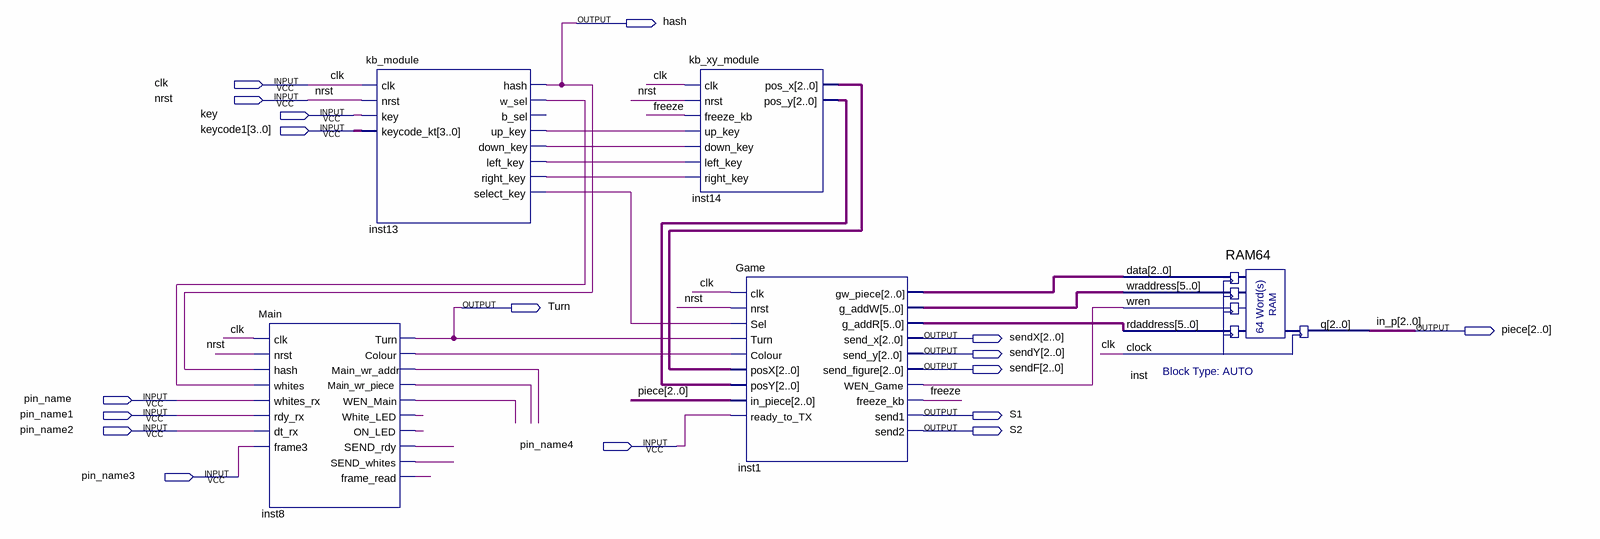
[diagram p0: schematic sheet]
// Quartus schematic bloc_1.bdf as structural Verilog: 5 symbols, 17 pins
module bloc_1 (
  input  clk,
  input  nrst,
  input  key,
  input  [3:0] keycode1,
  input  pin_name,
  input  pin_name1,
  input  pin_name2,
  input  pin_name4,
  input  pin_name3,
  output hash,
  output Turn,
  output [2:0] piece,
  output [2:0] sendX,
  output [2:0] sendY,
  output [2:0] sendF,
  output S1,
  output S2
);

  wire freeze, inst1_wen_game, inst8_colour, inst8_frame_read, inst8_main_wr_addr, inst8_main_wr_piece,
       inst8_on_led, inst8_send_rdy, inst8_send_whites, inst8_wen_main, inst8_white_led, inst13_down_key,
       inst13_left_key, inst13_right_key, inst13_select_key, inst13_up_key, inst13_w_sel;
  wire [2:0] inst1_gw_piece, inst14_pos_x, inst14_pos_y;
  wire [5:0] inst1_g_addr, inst1_g_addw;

  Main inst8 (
    .clk(clk), .nrst(nrst), .hash(hash), .whites(inst13_w_sel), .whites_rx(pin_name), .rdy_rx(pin_name1),
    .dt_rx(pin_name2), .frame3(pin_name3), .Turn(Turn), .Colour(inst8_colour),
    .Main_wr_addr(inst8_main_wr_addr), .Main_wr_piece(inst8_main_wr_piece), .WEN_Main(inst8_wen_main),
    .White_LED(inst8_white_led), .ON_LED(inst8_on_led), .SEND_rdy(inst8_send_rdy),
    .SEND_whites(inst8_send_whites), .frame_read(inst8_frame_read));
  kb_module inst13 (
    .clk(clk), .nrst(nrst), .key(key), .keycode_kt(keycode1), .hash(hash), .w_sel(inst13_w_sel),
    .up_key(inst13_up_key), .down_key(inst13_down_key), .left_key(inst13_left_key),
    .right_key(inst13_right_key), .select_key(inst13_select_key));  // open: b_sel
  kb_xy_module inst14 (
    .clk(clk), .nrst(nrst), .freeze_kb(freeze), .up_key(inst13_up_key), .down_key(inst13_down_key),
    .left_key(inst13_left_key), .right_key(inst13_right_key), .pos_x(inst14_pos_x), .pos_y(inst14_pos_y));
  Game inst1 (
    .clk(clk), .nrst(nrst), .Sel(inst13_select_key), .Turn(Turn), .Colour(inst8_colour), .posX(inst14_pos_x),
    .posY(inst14_pos_y), .in_piece(piece), .ready_to_TX(pin_name4), .gw_piece(inst1_gw_piece),
    .g_addW(inst1_g_addw), .g_addR(inst1_g_addr), .send_x(sendX), .send_y(sendY), .send_figure(sendF),
    .WEN_Game(inst1_wen_game), .freeze_kb(freeze), .send1(S1), .send2(S2));
  RAM64 inst (
    .data(inst1_gw_piece), .wraddress(inst1_g_addw), .wren(inst1_wen_game), .rdaddress(inst1_g_addr),
    .clock(clk), .q(piece));

  // Other names for the same wires on the sheet: in_p[2:0] = piece
endmodule
